# Altium schematic sheet Controles.SchDoc
size A3; SheetNumber: 12; SheetTotal: 12
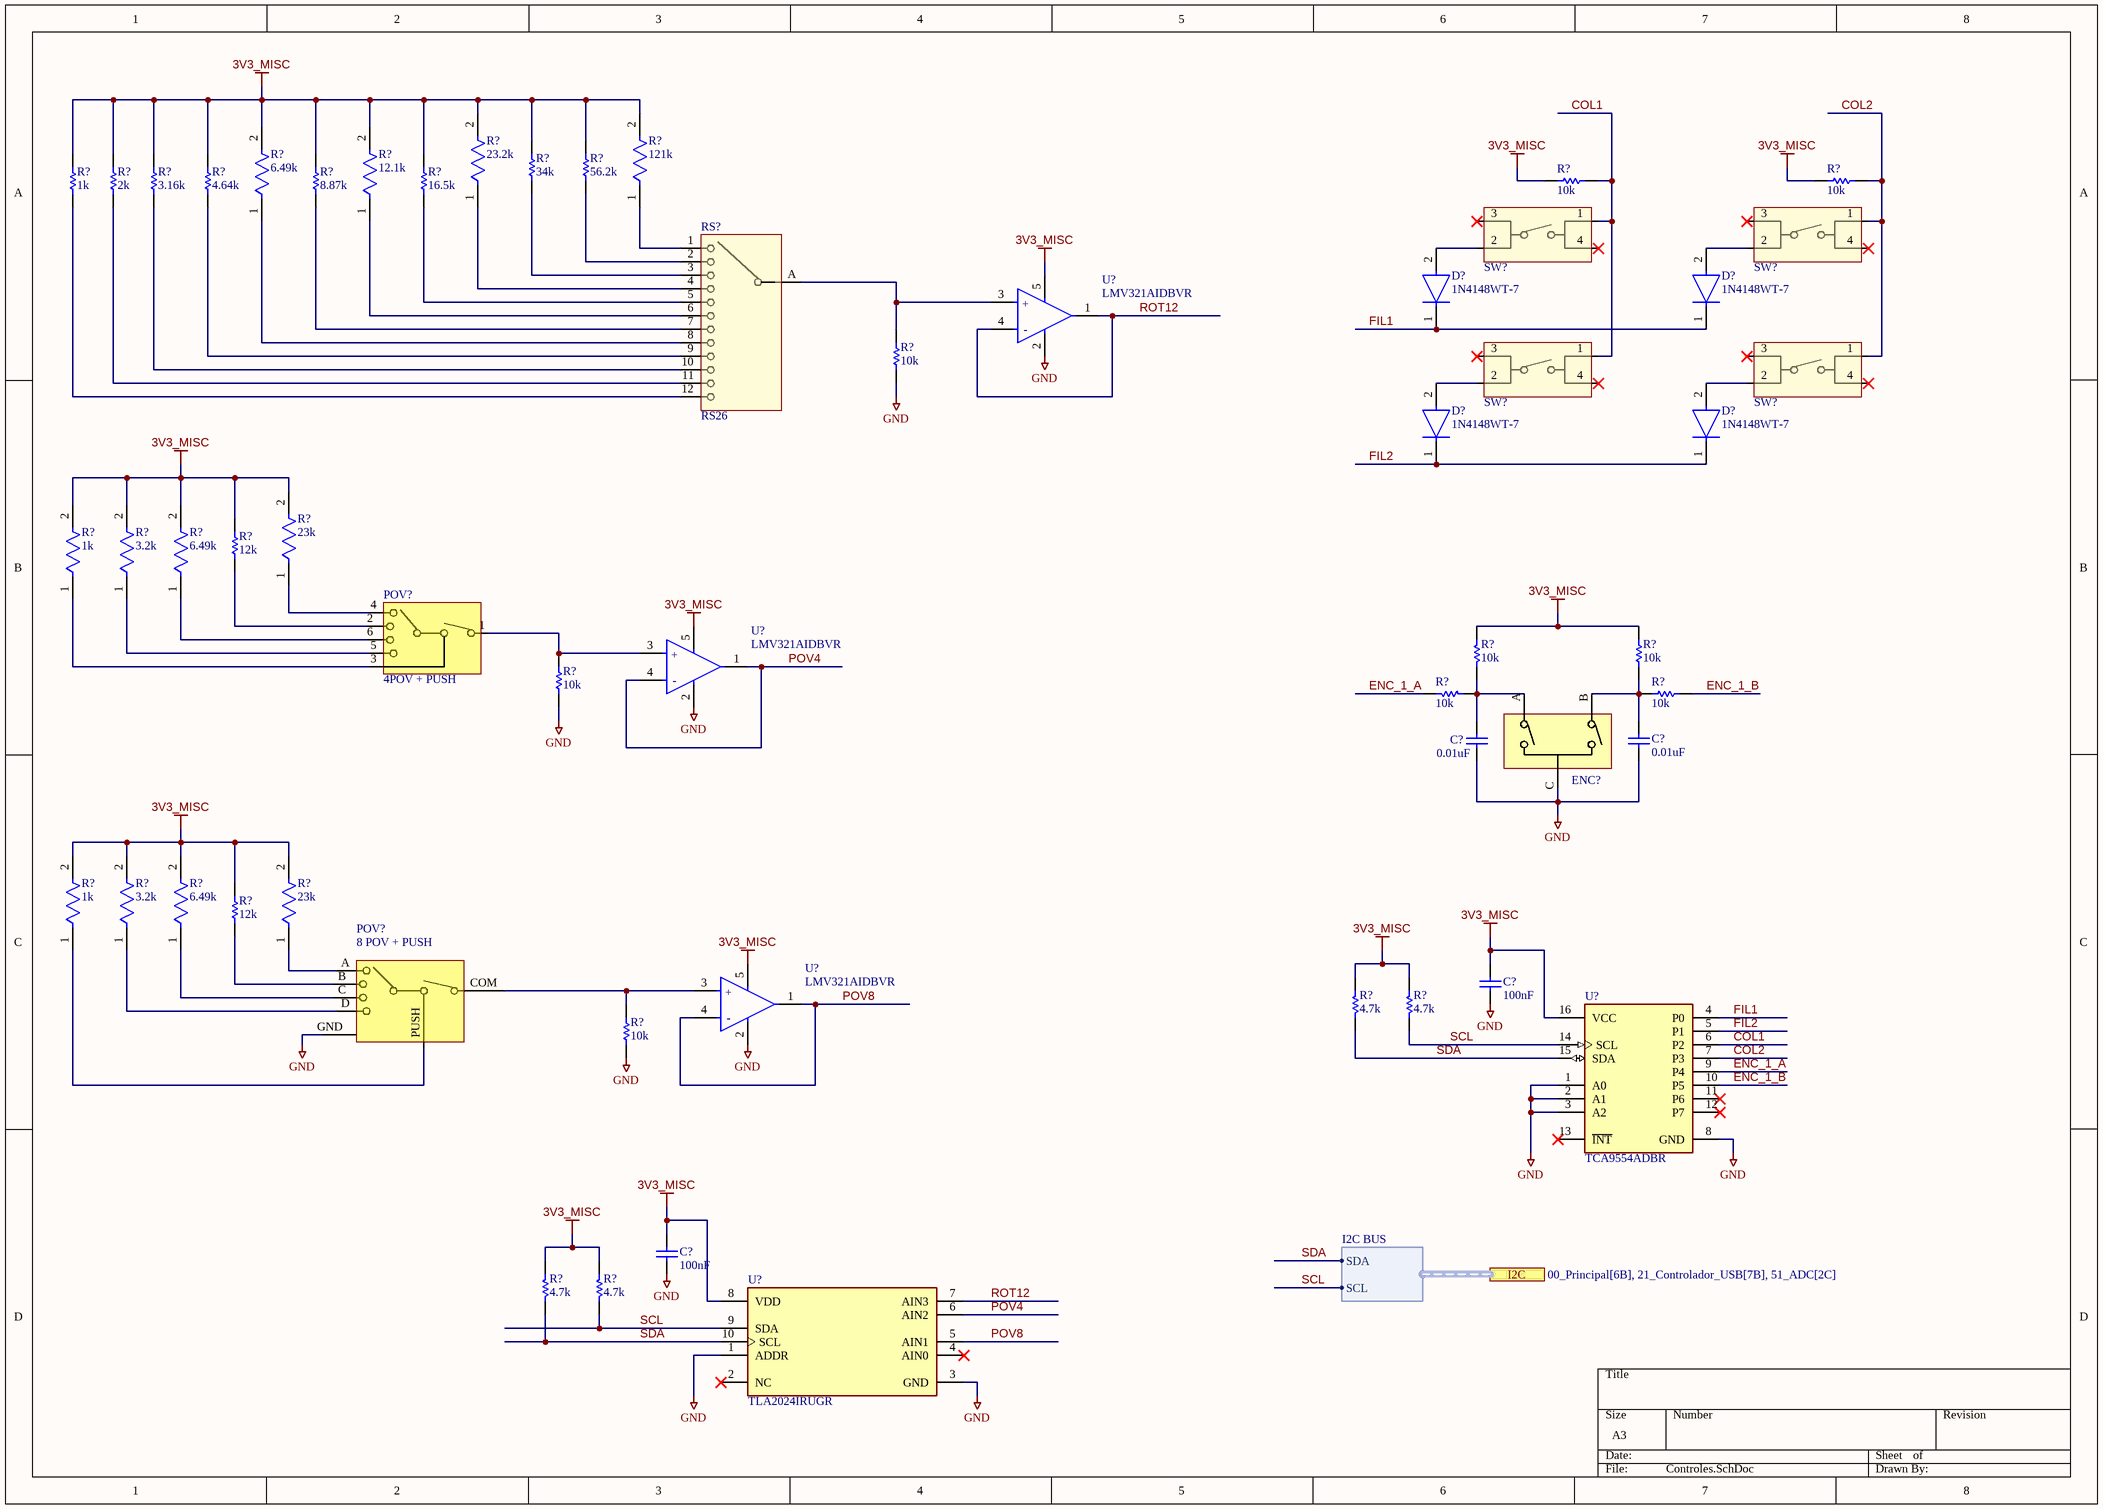
[diagram p0: Controles.SchDoc]

## Parts
(Parts that share a designator on the sheet are numbered #1, #2 ... from top to bottom, then left to right.)
C?#1  0.01uF  [CAPC1005X55X25LL05T10]
C?#2  0.01uF  [CAPC1005X55X25LL05T10]
C?#3  100nF  [CAPC1005X55X25NL05T05]
C?#4  100nF  [CAPC1005X55X25NL05T05]
D?#1  1N4148WT-7  [FP-SOD523-MFG]
D?#2  1N4148WT-7  [FP-SOD523-MFG]
D?#3  1N4148WT-7  [FP-SOD523-MFG]
D?#4  1N4148WT-7  [FP-SOD523-MFG]
ENC?  Encoder  [PEC09-2315F-N0015]  (value not drawn)
POV?#1  4POV + PUSH  [TSSJ 30]
POV?#2  8 POV + PUSH  [RKJXM1015004]
R?#1  34k  [RESC1005X40X25LL05T05]
R?#2  56.2k  [RESC1005X40X25LL05T05]
R?#3  1k  [RESC1005X40X25NL05T05]
R?#4  2k  [RESC1005X40X25LL10T10]
R?#5  3.16k  [RESC1005X40X25ML05T05]
R?#6  4.64k  [RESC1005X40X25LL05T05]
R?#7  8.87k  [RESC1005X40X25NL05T05]
R?#8  16.5k  [RESC1005X40X25LL05T05]
R?#9  10k  [RESC1005X40X25ML05T05]
R?#10  10k  [RESC1005X40X25ML05T05]
R?#11  23.2k  [FP-ERJ2R-MFG]
R?#12  121k  [FP-ERJ2R-MFG]
R?#13  6.49k  [FP-ERJ2RK-MFG]
R?#14  12.1k  [FP-ERJ2RK-IPC_C]
R?#15  10k  [RESC1005X40X25ML05T05]
R?#16  12k  [RESC0402(1005)_M]
R?#17  23k  [FP-AC0402-MFG]
R?#18  1k  [FP-MCS0402-IPC_B]
R?#19  3.2k  [FP-RN73R1E-IPC_A]
R?#20  6.49k  [FP-MCS0402-IPC_A]
R?#21  10k  [RESC1005X40X25ML05T05]
R?#22  10k  [RESC1005X40X25ML05T05]
R?#23  10k  [RESC1005X40X25ML05T05]
R?#24  10k  [RESC1005X40X25ML05T05]
R?#25  10k  [RESC1005X40X25ML05T05]
R?#26  12k  [RESC0402(1005)_M]
R?#27  1k  [FP-MCS0402-IPC_B]
R?#28  3.2k  [FP-RN73R1E-IPC_A]
R?#29  6.49k  [FP-MCS0402-IPC_A]
R?#30  23k  [FP-AC0402-MFG]
R?#31  4.7k  [RESC1005X40X25ML05T10]
R?#32  4.7k  [RESC1005X40X25ML05T10]
R?#33  10k  [RESC1005X40X25ML05T05]
R?#34  4.7k  [RESC1005X40X25ML05T10]
R?#35  4.7k  [RESC1005X40X25ML05T10]
RS?  RS26  [RS26]
SW?#1  KSC441G70SHLFSPF  [KSC441G 70SH LFS PF]  (value not drawn)
SW?#2  KSC441G70SHLFSPF  [KSC441G 70SH LFS PF]  (value not drawn)
SW?#3  KSC441G70SHLFSPF  [KSC441G 70SH LFS PF]  (value not drawn)
SW?#4  KSC441G70SHLFSPF  [KSC441G 70SH LFS PF]  (value not drawn)
U?#1  LMV321AIDBVR  [FP-DBV0005A-MFG]
U?#2  LMV321AIDBVR  [FP-DBV0005A-MFG]
U?#3  LMV321AIDBVR  [FP-DBV0005A-MFG]
U?#4  TCA9554ADBR  [FP-DB0016A-MFG]
U?#5  TLA2024IRUGR  [FP-RUG0010A-MFG]

## Ports
I2C (harness I2C BUS, see 00_Principal[6B], 21_Controlador_USB[7B], 51_ADC[2C])

## Harnesses
I2C BUS: SDA, SCL

## Nets
3V3_MISC: C?#3.2 C?#4.2 R?#1.2 R?#2.2 R?#3.2 R?#4.2 R?#5.2 R?#6.2 R?#7.2 R?#8.2 R?#9.2 R?#10.2 R?#11.2 R?#12.2 R?#13.2 R?#14.2 R?#16.2 R?#17.2 R?#18.2 R?#19.2 R?#20.2 R?#21.1 R?#22.1 R?#26.2 R?#27.2 R?#28.2 R?#29.2 R?#30.2 R?#31.2 R?#32.2 R?#34.2 R?#35.2 U?#1.5(V+) U?#2.5(V+) U?#3.5(V+) U?#4.16(VCC) U?#5.8(VDD)
GND: C?#1.1 C?#2.1 C?#3.1 C?#4.1 ENC?.C(COM) POV?#2.GND R?#15.1 R?#23.1 R?#33.1 U?#1.2(V-) U?#2.2(V-) U?#3.2(V-) U?#4.1(A0) U?#4.2(A1) U?#4.3(A2) U?#4.8(GND) U?#5.1(ADDR) U?#5.3(GND)
COL1: R?#9.1 SW?#1.1 SW?#3.1 U?#4.6(P2)
COL2: R?#10.1 SW?#2.1 SW?#4.1 U?#4.7(P3)
ENC_1_A: R?#24.1 U?#4.9(P4)
ENC_1_B: R?#25.1 U?#4.10(P5)
FIL1: D?#1.1(C) D?#2.1(C) U?#4.4(P0)
FIL2: D?#3.1(C) D?#4.1(C) U?#4.5(P1)
POV4: U?#2.1(OUT) U?#2.4(-IN) U?#5.6(AIN2)
POV8: U?#3.1(OUT) U?#3.4(-IN) U?#5.5(AIN1)
ROT12: U?#1.1(OUT) U?#1.4(-IN) U?#5.7(AIN3)
SCL: R?#32.1 R?#35.1 U?#4.14(SCL) U?#5.9(SDA) ; port I2C.SCL
SDA: R?#31.1 R?#34.1 U?#4.15(SDA) U?#5.10(SCL) ; port I2C.SDA
NetC?#1_2: C?#1.2 ENC?.A(COM) R?#21.2 R?#24.2
NetC?#2_2: C?#2.2 ENC?.B(COM) R?#22.2 R?#25.2
NetD?#1_2: D?#1.2(A) SW?#1.2
NetD?#2_2: D?#2.2(A) SW?#2.2
NetD?#3_2: D?#3.2(A) SW?#3.2
NetD?#4_2: D?#4.2(A) SW?#4.2
NetPOV?#1_1: POV?#1.1(COM) R?#23.2 U?#2.3(+IN)
NetPOV?#1_2: POV?#1.2(DIRB) R?#16.1
NetPOV?#1_3: POV?#1.3 R?#18.1
NetPOV?#1_4: POV?#1.4(DIRA) R?#17.1
NetPOV?#1_5: POV?#1.5(DIRD) R?#19.1
NetPOV?#1_6: POV?#1.6(DIRC) R?#20.1
NetPOV?#2_A: POV?#2.A(DIRA) R?#30.1
NetPOV?#2_B: POV?#2.B(DIRB) R?#26.1
NetPOV?#2_C: POV?#2.C(DIRC) R?#29.1
NetPOV?#2_COM: POV?#2.COM R?#33.2 U?#3.3(+IN)
NetPOV?#2_D: POV?#2.D(DIRD) R?#28.1
NetPOV?#2_PUSH: POV?#2.PUSH R?#27.1
NetR?#1_1: R?#1.1 RS?.3(A)
NetR?#2_1: R?#2.1 RS?.2(A)
NetR?#3_1: R?#3.1 RS?.12(A)
NetR?#4_1: R?#4.1 RS?.11(A)
NetR?#5_1: R?#5.1 RS?.10(A)
NetR?#6_1: R?#6.1 RS?.9(A)
NetR?#7_1: R?#7.1 RS?.7(A)
NetR?#8_1: R?#8.1 RS?.5(A)
NetR?#11_1: R?#11.1 RS?.4(A)
NetR?#12_1: R?#12.1 RS?.1(A)
NetR?#13_1: R?#13.1 RS?.8(A)
NetR?#14_1: R?#14.1 RS?.6(A)
NetR?#15_2: R?#15.2 RS?.A U?#1.3(+IN)

Not connected (* = marked no-connect by the designer): SW?#1 3(2)* 4(3)*; SW?#2 3(2)* 4(3)*; SW?#3 3(2)* 4(3)*; SW?#4 3(2)* 4(3)*; U?#4 11(P6)* 12(P7)* 13(~{INT})*; U?#5 2(NC)* 4(AIN0)*

## Notes on the sheet
- (in symbol CMP-04895-000333-1) +; -

## Library data of the parts
C?#1 C?#2 = CMP-1034-01880-2: Manufacturer: Murata; Part Number: GRM155R71E103KA01D
C?#3 C?#4 = CMP-2008-02030-1: Manufacturer: Vitramon; Part Number: VJ0402Y104KXJCW1BC
D?#1-D?#4 = CMP-2000-05518-3: DIODE GEN PURP 80V 125MA SOD523; Power Rating: 150mW; Peak Non-Repetitive Surge Current: 2A; Forward Voltage: 1.25V; Reverse Recovery Time: 4ns; Peak Reverse Current: 1uA; Max Repetitive Reverse Voltage (Vrrm): 100V; Capacitance: 2pF; Polarity: Standard; Element Configuration: Single; Forward Current: 250mA; Lead Free: Lead Free; Packaging: Tape and Reel; Length: 0.9mm; Min Operating Temperature: -65°C; Current Rating: 125mA; Max Reverse Voltage (DC): 80V; Width: 1.3mm; Package Quantity: 3000; Output Current: 125mA; Power Dissipation: 150mW; Max Operating Temperature: 150°C; Radiation Hardening: No; Average Rectified Current: 125mA; Height: 0.65mm; Voltage Rating (DC): 80V; Max Surge Current: 2A; Weight: 3.5E-05oz; Recovery Time: 4ns; Max Forward Surge Current (Ifsm): 2A; Contact Plating: Tin; Number of Pins: 2; Mount: Surface Mount; REACH SVHC: No SVHC
ENC? = PEC09-2315F-N0015: PEC09 PC Pin Quadrature (Incremental) 12 Mechanical Encoder 11.4mm 70C; Manufacturer: Bourns; Built in Switch: No; Detent: Yes; Number of Circuits: 1; Output Type: Incremental, Quadrature; Pulses per Revolution: 12; Supplier: DigiKey; Supplier Part Number: 118-PEC09-2315F-N0015-ND; Manufacturer Part Number: PEC09-2315F-N0015; RoHS: Compliant; Category: Encoders; Stock: 1221; Pricing: 1=2.47, 10=2.078, 25=1.9392, 50=1.8398, 100=1.745, 300=1.60387, 500=1.54196, 1000=1.46156, 5000=1.29003 (USD); Country of Origin: Taiwan; Encoder Type: Mechanical; Introduction Date: 2010-10-15; Lifecycle Status: Production; Max Operating Temperature: 70°C; Min Operating Temperature: -10°C; Mounting Technology: PCB, Panel, Through Hole; Orientation: Right Angle; REACH SVHC: Yes; Schedule B: 8543709655; Termination: PC Pin; Width: 9.7mm; ComponentLink1URL: https://datasheet.octopart.com:443/PEC09-2315F-N0015-Bourns-datasheet-179971531.pdf?src-supplier=IHS; ComponentLink1Description: https://datasheet.octopart.com:443/PEC09-2315F-N0015-Bourns-datasheet-179971531.pdf?src-supplier=IHS; ComponentLink2URL: https://datasheet.octopart.com:443/PEC09-2315F-N0015-Bourns-datasheet-67810299.pdf?src-supplier=JRH+Electronics; ComponentLink2Description: https://datasheet.octopart.com:443/PEC09-2315F-N0015-Bourns-datasheet-67810299.pdf?src-supplier=JRH+Electronics; ComponentLink3URL: https://datasheet.octopart.com:443/PEC09-2315F-N0015-Bourns-datasheet-177040331.pdf?src-supplier=Burklin+Elektronik; ComponentLink3Description: https://datasheet.octopart.com:443/PEC09-2315F-N0015-Bourns-datasheet-177040331.pdf?src-supplier=Burklin+Elektronik; ComponentLink4URL: https://datasheet.octopart.com/PEC09-2315F-N0015-Bourns-datasheet-10938969.pdf; ComponentLink4Description: https://datasheet.octopart.com/PEC09-2315F-N0015-Bourns-datasheet-10938969.pdf; ComponentLink5URL: http://sigma.octopart.com:80/conflict_mineral_statement/Bourns-company-36.pdf?src-supplier=Compliance+Statements; ComponentLink5Description: http://sigma.octopart.com:80/conflict_mineral_statement/Bourns-company-36.pdf?src-supplier=Compliance+Statements
POV?#1 = TSSJ 30: SWITCH NAVIGATION 20MA 15V
POV?#2 = RKJXM1015004: 8-directional Stick Switch (with Center-push Function) RKJXM Series
R?#1 = CMP-1011-00682-2: Part Number: ERJ-2RKF3402X; Manufacturer: Panasonic
R?#2 = CMP-2002-00996-1: Part Number: ERJ-2RKF5622X; Manufacturer: Panasonic
R?#3 = CMP-1011-00510-4: Chip Resistor, 1 KOhm, +/- 1%, 100 mW, -55 to 155 degC, 0402 (1005 Metric), RoHS, Tape and Reel; PartNumber: ERJ-2RKF1001X; Manufacturer: Basic Passives; Voltage Rating: 50 V; Case\/Package: 0402; Resistance: 1 KOhm; Power Rating: 100 mW; DatasheetVersion: 04/2015; Radiation Hardening: No; Pins: 2; Height: 0.35 mm; RoHSCompliant: true; Case Code (Imperial): 0402; ComponentLink2Description: Datasheet; ComponentLink1Description: Manufacturer URL; PackageReference: 0402; Mount: Surface Mount; Package Quantity: 10000; Tolerance: 1%; ComponentLink1URL: http://www.panasonic.com/; PackageDescription: 2-Pin Surface Mount Device, Body 1 x 0.5 mm; Mounting Technology: Surface Mount; Case Code (Metric): 1005; ComponentLink2URL: http://industrial.panasonic.com/cdbs/www-data/pdf/RDA0000/AOA0000C86.pdf; REACH SVHC: Yes; Packaging: Tape and Reel; Max Operating Temperature: 155 degC; Min Operating Temperature: -55 degC; Width: 0.5 mm; Length: 1 mm
R?#4 = CMP-2002-05790-1: Manufacturer: Panasonic; Part Number: ERA-2AEB202X
R?#5 = CMP-2002-00861-1: Manufacturer: Panasonic; Part Number: ERJ-2RKF3161X
R?#6 = CMP-2002-00951-1: Part Number: ERJ-2RKF4641X; Manufacturer: Panasonic
R?#7 = CMP-1011-00617-2: Part Number: ERJ-2RKF8871X; Manufacturer: Panasonic
R?#8 = CMP-2002-00717-1: Part Number: ERJ-2RKF1652X; Manufacturer: Panasonic
R?#9 R?#10 R?#15 R?#21-R?#25 R?#33 = CMP-2002-00601-1: Manufacturer: Panasonic; Part Number: ERJ-2RHD1002X
R?#11 = CMP-1011-00662-3: RES SMD 23.2K OHM 1% 1/10W 0402; Manufacturer Part Number: ERJ-2RKF2322X; Manufacturer: Panasonic; Voltage Rating: 50V; Power Rating: 0.1W; Resistance: 23.2kΩ; Temperature Coefficient: 100%; Automotive Grade: Grade 0; Value: 23.2kΩ; Package: ERJ2R; Device Class L2: Resistors; Height: 0.4mm; Temperature Range High: +155°C; Device Class L1: Passive Components; Temperature Range Low: -55°C; Device Class L3: Chip SMD Resistors; ComponentLink2Description: Datasheet; Temperature: -55°C to +155°C; Footprint Url: https://industrial.panasonic.com/cdbs/www-data/pdf/RDA0000/DMA0000COL17.pdf; Category: Res; Automotive: Yes; ComponentLink2URL: https://industrial.panasonic.com/cdbs/www-data/pdf/RDA0000/AOA0000C304.pdf; Digikey Description: RES SMD 23.2K OHM 1% 1/10W 0402; Ipc Land Pattern Name: RESC10050X35; Tolerance: 1%; Lead Free: Yes; RoHS: TRUE; Octopart: https://octopart.com/erj-2rkf2322x-panasonic-55421023; Mouser Description: Thick Film Resistors - SMD 0402 23.2Kohms 1% AEC-Q200; Series: ERJ; Composition: Thick Film
R?#12 = CMP-2002-00650-2: RES SMD 121K OHM 1% 1/10W 0402; Manufacturer: Panasonic; Manufacturer Part Number: ERJ-2RKF1213X; Voltage Rating: 50V; Power Rating: 0.1W; Value: 121kΩ; Automotive Grade: Grade 0; Temperature Coefficient: 100ppm/°C; Temperature: -55°C to +155°C; Footprint Url: https://industrial.panasonic.com/cdbs/www-data/pdf/RDA0000/DMA0000COL17.pdf; RoHS: TRUE; Ipc Land Pattern Name: RESC10050X35; Automotive: Yes; ComponentLink2Description: Datasheet; Temperature Range Low: -55°C; Octopart: https://octopart.com/erj-2rkf1213x-panasonic-55420883; Category: Res; Package: ERJ2R; Mouser Description: Thick Film Resistors - SMD 0402 121Kohms 1% Tol; Device Class L2: Resistors; Device Class L3: Chip SMD Resistors; Height: 0.4mm; Device Class L1: Passive Components; Tolerance: 1%; Series: ERJ; Digikey Description: RES SMD 121K OHM 1% 1/10W 0402; Temperature Range High: +155°C; Lead Free: Yes; Composition: Thick Film; ComponentLink2URL: https://industrial.panasonic.com/cdbs/www-data/pdf/RDA0000/AOA0000C304.pdf; Resistance: 121kΩ
R?#13 = CMP-2002-01028-2: NexarPartId: 55421257; Max Power Dissipation: 100mW; Resistance: 6.49kΩ; Voltage Rating: 50V; Tolerance: 1%; Temperature Coefficient: 100ppm/°C; RoHS: Compliant; Number of Terminations: 2; Case Code (Metric): 1005; Schedule B: 8533210045, 8533210045; Composition: Thick Film; Lead Free: Lead Free; Length: 1mm; Voltage Rating (DC): 50V; Max Operating Temperature: 155°C; Width: 508µm; Case Code (Imperial): 0402; REACH SVHC: No SVHC; Depth: 500µm; Contact Plating: Tin; Power Rating: 100mW; Military Standard: Not; Termination: SMD/SMT; Case/Package: 0402; Min Operating Temperature: -55°C; Packaging: Cut Tape; Height: 406.4µm; Lifecycle Status: Production; Mount: Surface Mount
R?#14 = CMP-2002-00649-2: RES SMD 12.1K OHM 1% 1/10W 0402; Voltage Rating (DC): 50V; Power Rating: 100mW; Temperature Coefficient: 100ppm/°C; Resistance: 12.1kR; Width: 0.02inch; Military Standard: Not; Resistance Tolerance: 1%; Resistor Type: Thick Film; Voltage Rating: 50V; Case/Package: 0402; Packaging: Tape and Reel; Series: ERJ; Number of Terminations: 2; Case Code (Metric): 1005; Radiation Hardening: No; Min Operating Temperature: -55°C; Construction: Rectangular; Technology: THICK FILM; RoHS Compliant: Yes; Termination: SMD/SMT; Contact Plating: Tin; Max Operating Temperature: 155°C; Max Power Dissipation: 100mW; Tolerance: 1%; Features: Automotive AEC-Q200; Height: 0.35mm; REACH SVHC: No SVHC; Depth: 0.5mm; Case Code (Imperial): 0402; Lead Free: Lead Free; Length: 1mm; Mount: Surface Mount; Package Quantity: 1
R?#16 R?#26 = CMP-1011-00100-1: 12K 0.063W 5% 0402 (1005 Metric)  SMD; Case-Metric: 1005; Value: 12000.00 Ohm; Case-EIA: 0402; Technology: SMT; Tolerance: 5 %; Power: 0.063 W
R?#17 R?#30 = CMP-03412-015848-2: RES 23.2kΩ ±1% 0.063W 0402; Resistance: 23.2kR; Max Power Dissipation: 63mW; Temperature Coefficient: 100ppm/°C; Features: Moisture Resistant; Military Standard: Not; Max Operating Temperature: 155°C; RoHS Compliant: Yes; Resistor Type: Thick Film; Min Operating Temperature: -55°C; Length: 0.039inch; Height: 0.015inch; Number of Terminations: 2; Width: 0.02inch; Series: AC; Depth: 0.5mm; Tolerance: 1%; Packaging: Tape and Reel; Case/Package: 0402
R?#18 R?#27 = CMP-2002-02445-2: RES SMD 1.2K OHM 1% 1/10W 0402; Resistance: 1kR; Tolerance: 0.1%; Max Power Dissipation: 63mW; Temperature Coefficient: 25ppm/°C; Max Operating Temperature: 125°C; Min Operating Temperature: -55°C; Case/Package: 0402; Packaging: Tape and Reel; Width: 0.02inch; Lead Free: Lead Free; Number of Terminations: 2; Height: 0.015inch; Package Quantity: 10000; Length: 0.039inch; Composition: Thin Film; Contact Plating: Tin; Depth: 0.5mm; Military Standard: Not
R?#19 R?#28 = CMP-04015-034609-1: 3.2kΩ ±0.1% 0.063W, 1/16W Chip Resistor 0402 (1005 Metric) Moisture Resistant Thin Film
R?#20 R?#29 = CMP-02407-008176-1: RES SMD 1.2K OHM 1% 1/10W 0402; Temperature Coefficient: 50ppm/°C; Resistance: 6.49kR; Max Power Dissipation: 100mW; Packaging: Tape and Reel; Lead Free: Lead Free; Tolerance: 1%; Case/Package: 0402; Length: 0.039inch; Height: 0.015inch; Package Quantity: 10000; Depth: 0.5mm; Composition: Thin Film; Width: 0.02inch; Min Operating Temperature: -55°C; Number of Terminations: 2; Military Standard: Not; Max Operating Temperature: 155°C
R?#31 R?#32 R?#34 R?#35 = CMP-2002-06456-1: Manufacturer: Panasonic; Part Number: ERJ-S02F4701X
RS? = RS26 Rotary Coder: RS26 Rotary Type Band Switch Position Switch
SW?#1-SW?#4 = KSC441G70SHLFSPF: Switch Tactile N.O. SPST Button 1VA 32VDC 50mA 4N Gull Wing SMD T/R; Manufacturer: C&K Components; Supplier: DigiKey; Supplier Part Number: CKN11980CT-ND; Manufacturer Part Number: KSC441G70SHLFSPF; RoHS: Compliant; Category: Tactile Switches; Stock: 1; Pricing: 1=1.04, 10=0.887, 25=0.8248, 100=0.7353, 250=0.6812, 500=0.64368 (USD); Contact Current Rating: 50mA; Operating Force: 4N; ComponentLink1URL: https://datasheet.octopart.com:443/KSC441G70SHLFSPF-C%26K-Components-datasheet-128529453.pdf?src-supplier=Electro+Sonic; ComponentLink1Description: https://datasheet.octopart.com:443/KSC441G70SHLFSPF-C%26K-Components-datasheet-128529453.pdf?src-supplier=Electro+Sonic; ComponentLink2URL: https://datasheet.octopart.com:443/KSC441G70SHLFSPF-C%26K-Components-datasheet-100062959.pdf?src-supplier=Future+Electronics; ComponentLink2Description: https://datasheet.octopart.com:443/KSC441G70SHLFSPF-C%26K-Components-datasheet-100062959.pdf?src-supplier=Future+Electronics; Supplier 1: DigiKey; Supplier Part Number 1: CKN11980CT-ND
U?#1-U?#3 = CMP-04895-000333-1: IC OPAMP GP 1 CIRCUIT SOT23-5; Input Bias Current: 10pA; Output Current per Channel: 40mA; Gain Bandwidth Product: 1MHz; Input Offset Voltage (Vos): 1mV; Number of Channels: 1; Operating Supply Current: 80uA; Slew Rate: 1.7V/µs; Mount: Surface Mount; Min Operating Temperature: -40°C; Packaging: Cut Tape; Case/Package: SOT-23-5; RoHS Compliant: Yes; Max Operating Temperature: 125°C; Number of Circuits: 1
U?#4 = CMP-04886-000016-1: IC SMBUS I/O EXPANDER I2C 16SSOP; Min Supply Voltage: 1.65V; Max Supply Voltage: 5.5V; Frequency: 400kHz; Number of I/Os: 8; Output Type: PUSH-PULL; Lead Free: Lead Free; RoHS Compliant: Yes; Packaging: Cut Tape; Series: -; Max Operating Temperature: 85°C; Min Operating Temperature: -40°C; Interface: I2C; Mount: Surface Mount; Case/Package: SSOP; Number of Pins: 16; REACH SVHC: No SVHC
U?#5 = CMP-04860-000013-1: IC ADC 12BIT SIGMA-DELTA 10X2QFN; Number of A/D Converters: 1; Interface: I2C; Number of Bits: 12; Sampling Rate: 3300S/s; Number of Inputs: 4; Mount: Surface Mount; Max Operating Temperature: 85°C; Min Operating Temperature: -40°C; RoHS Compliant: Yes; Packaging: Tape and Reel